# EAGLE design MOTOR_SLAVE_BRD_1 (EAGLE 9.5.2)
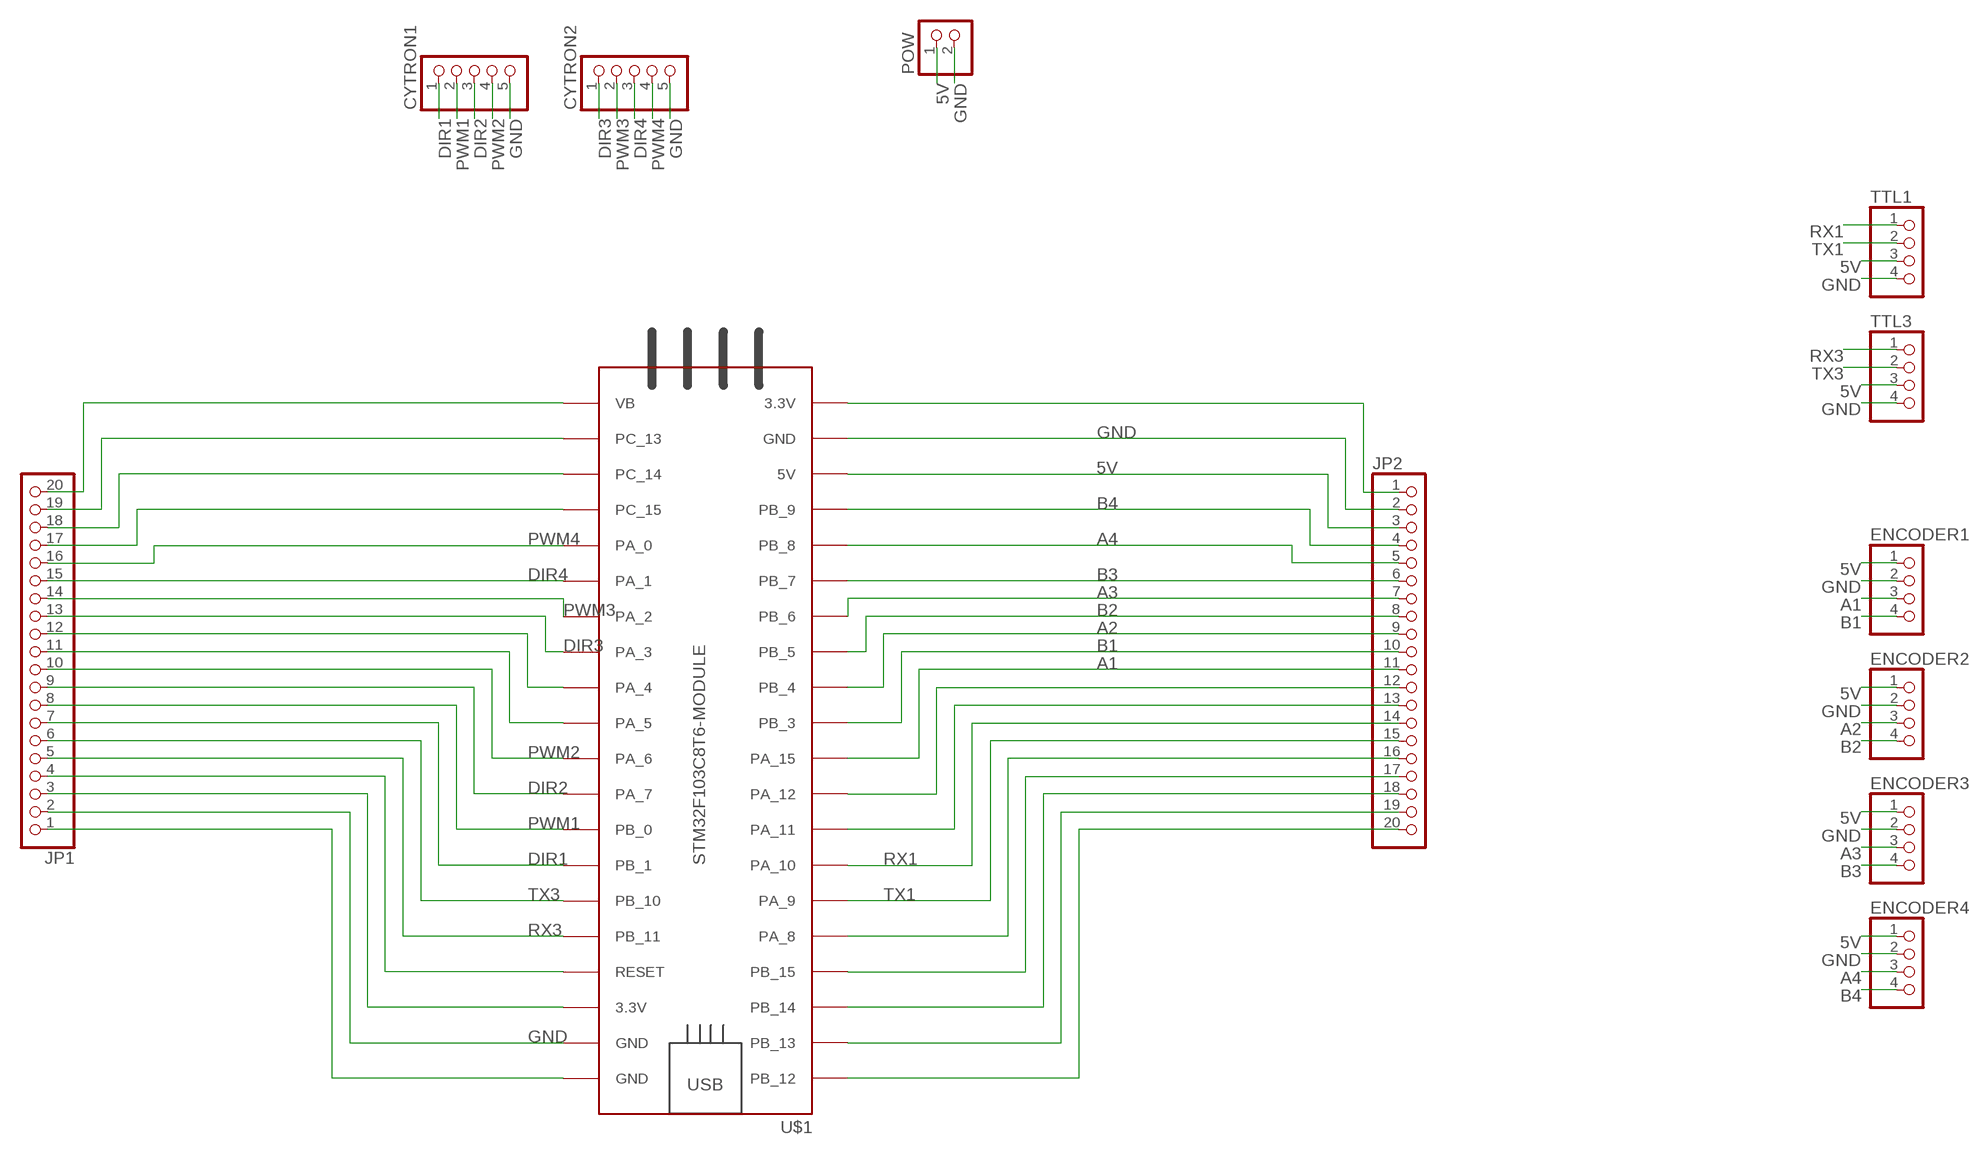
[diagram p0: schematic, sheet 1]

## Parts
CYTRON1  PINHD-5_DATA  [1X05_DATA]
CYTRON2  PINHD-5_DATA  [1X05_DATA]
ENCODER1  PINHD-4_DATA  [1X04_DATA]
ENCODER2  PINHD-4_DATA  [1X04_DATA]
ENCODER3  PINHD-4_DATA  [1X04_DATA]
ENCODER4  PINHD-4_DATA  [1X04_DATA]
JP1  PINHD-1X20  [1X20]
JP2  PINHD-1X20  [1X20]
POW  PINHD-2_DATA  [1X02_DATA]
TTL1  PINHD-4_DATA  [1X04_DATA]
TTL3  PINHD-4_DATA  [1X04_DATA]
U$1  STM32F103C8T6-MODULE  [STM32F103C8T6-MODULE]

## Nets
5V: ENCODER1.1 ENCODER2.1 ENCODER3.1 ENCODER4.1 JP2.3 POW.1 TTL1.3 TTL3.3 U$1.5V
A1: ENCODER1.3 JP2.11 U$1.PA_15
A2: ENCODER2.3 JP2.9 U$1.PB_4
A3: ENCODER3.3 JP2.7 U$1.PB_6
A4: ENCODER4.3 JP2.5 U$1.PB_8
B1: ENCODER1.4 JP2.10 U$1.PB_3
B2: ENCODER2.4 JP2.8 U$1.PB_5
B3: ENCODER3.4 JP2.6 U$1.PB_7
B4: ENCODER4.4 JP2.4 U$1.PB_9
DIR1: CYTRON1.1 JP1.7 U$1.PB_1
DIR2: CYTRON1.3 JP1.9 U$1.PA_7
DIR3: CYTRON2.1 JP1.13 U$1.PA_3
DIR4: CYTRON2.3 JP1.15 U$1.PA_1
GND: CYTRON1.5 CYTRON2.5 ENCODER1.2 ENCODER2.2 ENCODER3.2 ENCODER4.2 JP1.2 JP2.2 POW.2 TTL1.4 TTL3.4 U$1.GND_1(GND) U$1.GND_2(GND)
N$1: JP1.20 U$1.VB
N$2: JP1.19 U$1.PC_13
N$3: JP1.18 U$1.PC_14
N$5: JP1.17 U$1.PC_15
N$9: JP1.12 U$1.PA_4
N$10: JP1.11 U$1.PA_5
N$17: JP1.4 U$1.RESET
N$18: JP1.3 U$1.3.3V_2(3.3V)
N$20: JP1.1 U$1.GND_3(GND)
N$21: JP2.1 U$1.3.3V_1(3.3V)
N$32: JP2.12 U$1.PA_12
N$33: JP2.13 U$1.PA_11
N$36: JP2.16 U$1.PA_8
N$37: JP2.17 U$1.PB_15
N$38: JP2.18 U$1.PB_14
N$39: JP2.19 U$1.PB_13
N$40: JP2.20 U$1.PB_12
PWM1: CYTRON1.2 JP1.8 U$1.PB_0
PWM2: CYTRON1.4 JP1.10 U$1.PA_6
PWM3: CYTRON2.2 JP1.14 U$1.PA_2
PWM4: CYTRON2.4 JP1.16 U$1.PA_0
RX1: JP2.14 TTL1.1 U$1.PA_10
RX3: JP1.5 TTL3.1 U$1.PB_11
TX1: JP2.15 TTL1.2 U$1.PA_9
TX3: JP1.6 TTL3.2 U$1.PB_10

## Library data of the parts
CYTRON1 CYTRON2 = MIA_LIBRARY-2-2-2:PINHD-5_DATA: PIN HEADER
ENCODER1-ENCODER4 TTL1 TTL3 = MIA_LIBRARY-2-2-2:PINHD-4_DATA: PIN HEADER
JP1 JP2 = MIA_LIBRARY-2-2-2:PINHD-1X20: PIN HEADER
POW = MIA_LIBRARY-2-2-2:PINHD-2_DATA: PIN HEADER
U$1 = MIA_LIBRARY-2-2-2:STM32F103C8T6-MODULE: STM32F103C8T6 module with ARM Cortex-3, 20kB SRAM, 64kB Flash, 72MHz

## Board
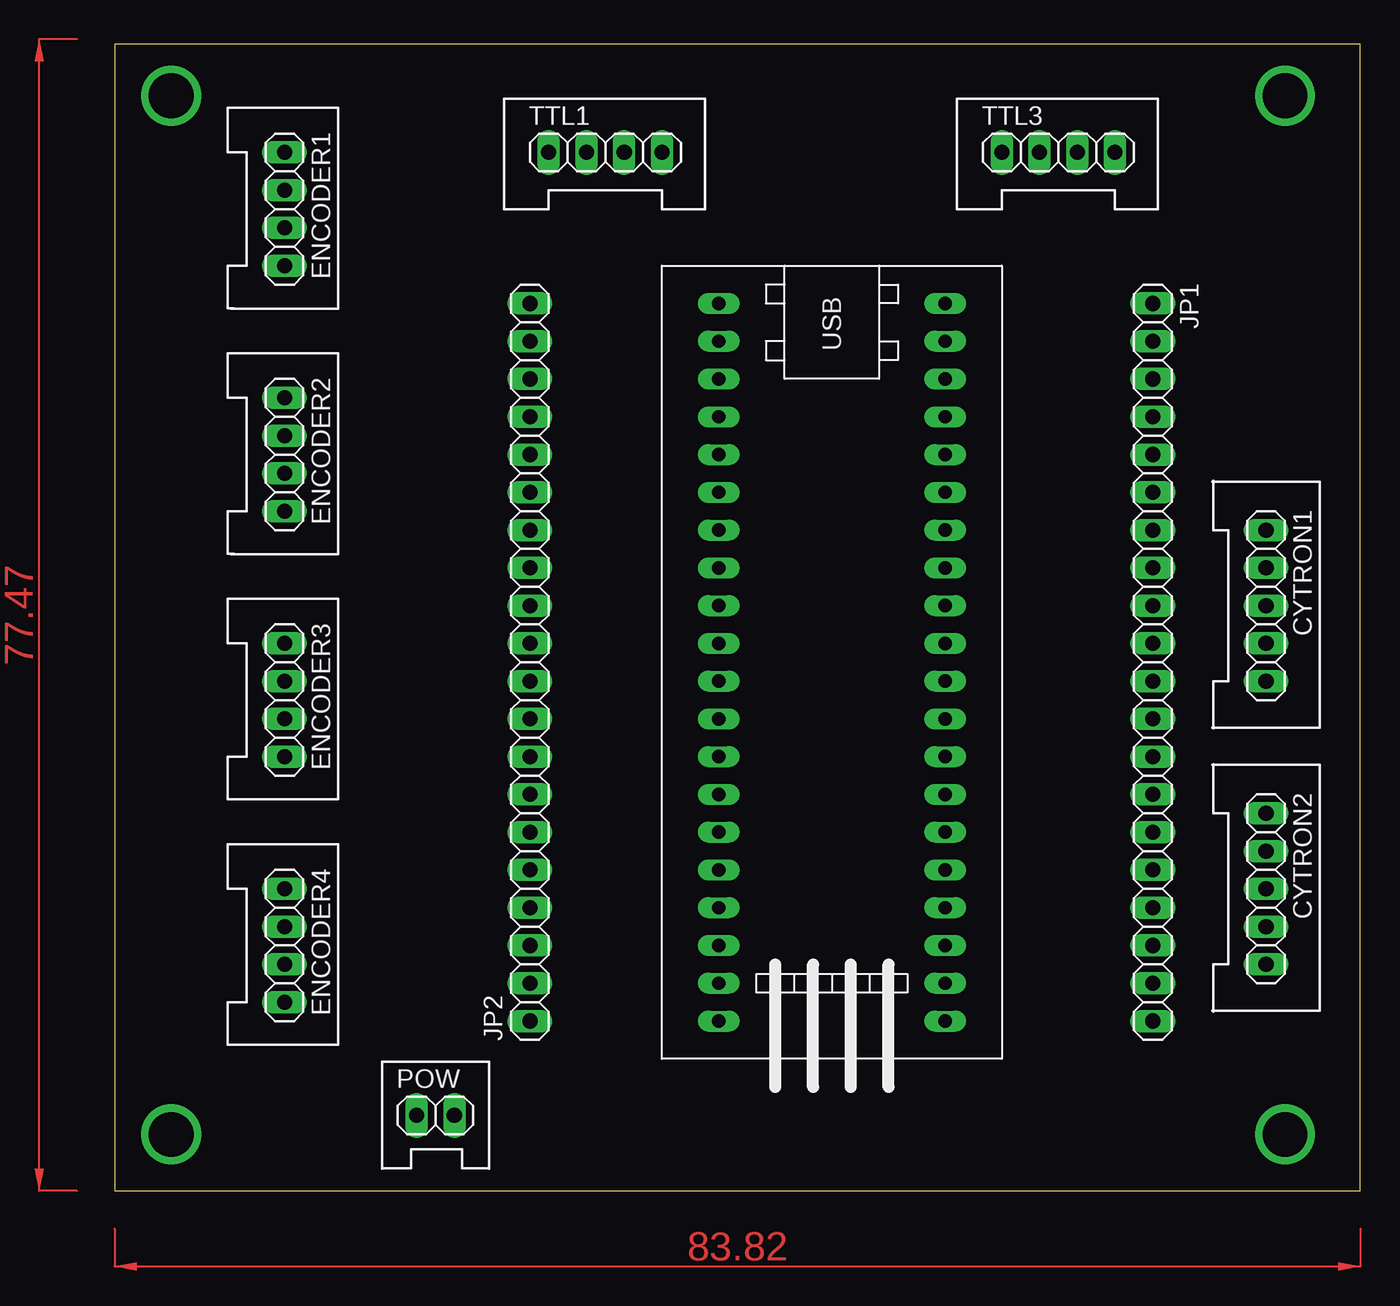
[diagram p1: board, top side]
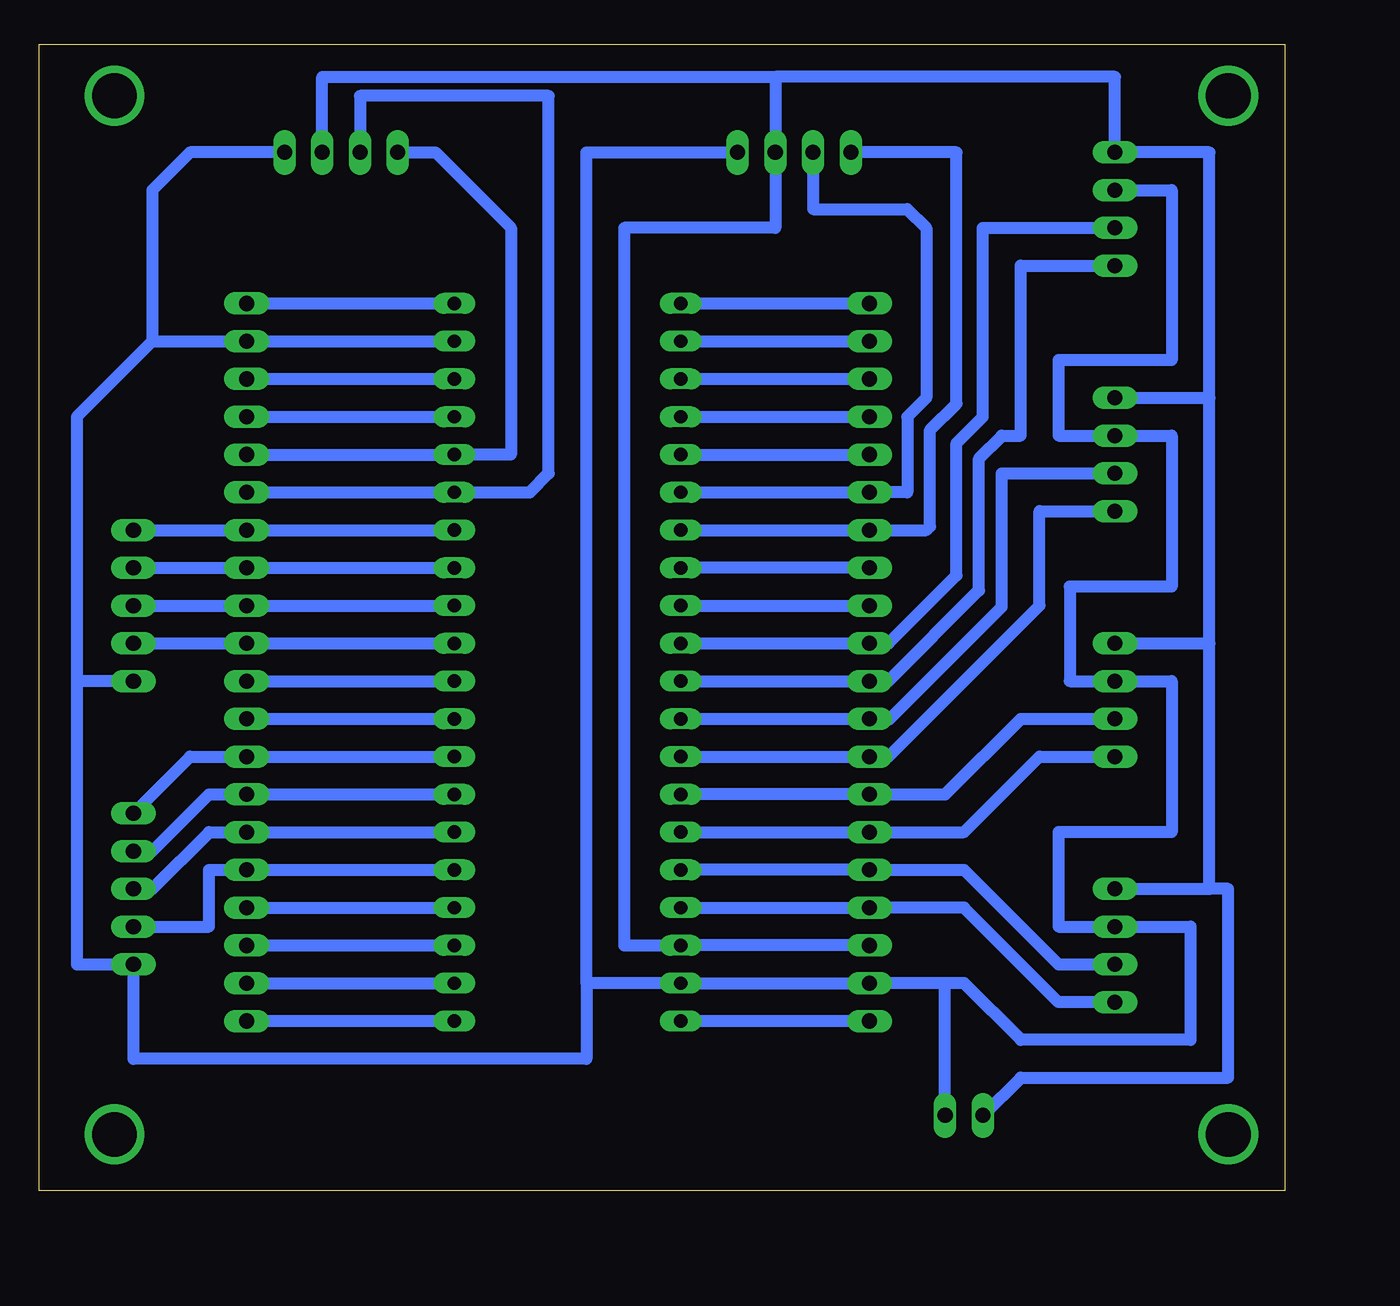
[diagram p2: board, bottom side, seen from below]

Size 83.8 x 77.14 mm. Coordinates in mm from the lower left corner, seen from the top.
Outline: 0,0 83.8,0 83.8,77.14 0,77.14 0,0
Copper layers (1*16): Top 0.035mm / dielectric 1.5mm / Bottom 0.035mm
Design rules "default": minimum track width 6mil, minimum drill 0.35mm, track to track 6mil, track to pad 6mil, pad to pad 6mil, via to via 6mil, smd to smd 6mil, copper to edge 40mil, drill to drill 6mil, minimum pad ring 10mil, minimum via ring 8mil, stop-mask expansion 4mil, vias tented up to drill 0mil, thermal gap 10mil

### Footprints (pad centres in the part's own frame; a part is rotated, then mirrored left to right if it is on the bottom)
1X05_DATA = drill 1.016 long: 1 -5.08,0; 2 -2.54,0; 3 0,0; 4 2.54,0; 5 5.08,0
1X04_DATA = drill 1.016 long: 1 -3.81,0; 2 -1.27,0; 3 1.27,0; 4 3.81,0
1X20 = drill 1.016 long: 1 -24.13,0; 2 -21.59,0; 3 -19.05,0; 4 -16.51,0; 5 -13.97,0; 6 -11.43,0; 7 -8.89,0; 8 -6.35,0; 9 -3.81,0; 10 -1.27,0; 11 1.27,0; 12 3.81,0; 13 6.35,0; 14 8.89,0; 15 11.43,0; 16 13.97,0; 17 16.51,0; 18 19.05,0; 19 21.59,0; 20 24.13,0
1X02_DATA = drill 1.016 long: 1 -1.27,0; 2 1.27,0
STM32F103C8T6-MODULE = drill 0.9 long: 3.3V_1 25.4,-7.62; 3.3V_2 -17.78,7.62; 5V 20.32,-7.62; GND_1 22.86,-7.62; GND_2 -20.32,7.62; GND_3 -22.86,7.62; PA_0 15.24,7.62; PA_1 12.7,7.62; PA_2 10.16,7.62; PA_3 7.62,7.62; PA_4 5.08,7.62; PA_5 2.54,7.62; PA_6 0,7.62; PA_7 -2.54,7.62; PA_8 -12.7,-7.62; PA_9 -10.16,-7.62; PA_10 -7.62,-7.62; PA_11 -5.08,-7.62; PA_12 -2.54,-7.62; PA_15 0,-7.62; PB_0 -5.08,7.62; PB_1 -7.62,7.62; PB_3 2.54,-7.62; PB_4 5.08,-7.62; PB_5 7.62,-7.62; PB_6 10.16,-7.62; PB_7 12.7,-7.62; PB_8 15.24,-7.62; PB_9 17.78,-7.62; PB_10 -10.16,7.62; PB_11 -12.7,7.62; PB_12 -22.86,-7.62; PB_13 -20.32,-7.62; PB_14 -17.78,-7.62; PB_15 -15.24,-7.62; PC_13 22.86,7.62; PC_14 20.32,7.62; PC_15 17.78,7.62; RESET -15.24,7.62; VB 25.4,7.62

### Placement (x,y rotation side)
CYTRON1  77.47,39.37 270 top
CYTRON2  77.47,20.32 270 top
ENCODER1  11.43,66.04 270 top
ENCODER2  11.43,49.53 270 top
ENCODER3  11.43,33.02 270 top
ENCODER4  11.43,16.51 270 top
JP1  69.85,35.56 270 top
JP2  27.94,35.56 90 top
POW  21.59,5.08 0 top
TTL1  33.02,69.85 0 top
TTL3  63.5,69.85 0 top
U$1  48.26,36.83 270 top

### Tracks (layer width: path | path; a pad name or v marks a point on that pad's centre or on a via)
5V
  Bottom 0.813: JP2.3 U$1.5V 44.45,16.51 44.45,64.77 34.29,64.77 TTL1.3 34.29,74.93 | TTL3.3 64.77,74.93 34.29,74.93 | 34.29,74.93 11.43,74.93 ENCODER1.1 5.08,69.85 5.08,53.34 | ENCODER4.1 5.08,20.32 | 5.08,20.32 5.08,36.83 | 5.08,36.83 5.08,53.34 | ENCODER2.1 5.08,53.34 | ENCODER3.1 5.08,36.83 | POW.1 17.78,7.62 3.81,7.62 3.81,20.32 5.08,20.32
A1
  Bottom 0.813: U$1.PA_15 JP2.11 26.67,36.83 22.1,41.4 22.1,50.29 20.32,52.07 20.32,53.34 20.32,54.61 20.32,64.77 ENCODER1.3
A2
  Bottom 0.813: U$1.PB_4 JP2.9 27.89,31.7 26.63,31.7 19.05,39.28 19.05,48.26 ENCODER2.3
A3
  Bottom 0.813: U$1.PB_6 JP2.7 22.86,26.67 17.78,31.75 ENCODER3.3
A4
  Bottom 0.813: U$1.PB_8 JP2.5 21.59,21.59 15.24,15.24 ENCODER4.3
B1
  Bottom 0.813: U$1.PB_3 JP2.10 26.67,34.29 20.57,40.39 20.57,49.28 19.05,50.8 17.78,50.8 17.78,62.23 ENCODER1.4
B2
  Bottom 0.813: U$1.PB_5 JP2.8 26.67,29.21 16.51,39.37 16.51,45.72 ENCODER2.4
B3
  Bottom 0.813: U$1.PB_7 JP2.6 21.59,24.13 16.51,29.21 ENCODER3.4
B4
  Bottom 0.813: U$1.PB_9 JP2.4 21.59,19.05 15.24,12.7 ENCODER4.4
DIR1
  Bottom 0.813: U$1.PB_1 JP1.7 CYTRON1.1
DIR2
  Bottom 0.813: U$1.PA_7 JP1.9 CYTRON1.3
DIR3
  Bottom 0.813: U$1.PA_3 JP1.13 73.66,29.21 CYTRON2.1
DIR4
  Bottom 0.813: U$1.PA_1 JP1.15 72.39,24.13 76.2,20.32 CYTRON2.3
GND
  Bottom 0.813: U$1.GND_2 JP1.2 76.2,57.15 | TTL3.4 73.66,69.85 76.2,67.31 76.2,57.15 | ENCODER1.2 7.62,67.31 7.62,55.88 15.24,55.88 15.24,50.8 ENCODER2.2 7.62,50.8 7.62,40.64 14.48,40.64 14.48,34.29 ENCODER3.2 7.62,34.29 7.62,24.13 15.24,24.13 15.24,17.78 ENCODER4.2 6.35,17.78 6.35,10.16 17.78,10.16 21.59,13.97 22.86,13.97 | 22.86,13.97 JP2.2 U$1.GND_1 46.99,13.97 | TTL1.4 46.99,69.85 46.99,13.97 | POW.2 22.86,13.97 | 46.99,13.97 46.99,8.89 77.47,8.89 CYTRON2.5 81.28,15.24 81.28,34.29 | CYTRON1.5 81.28,34.29 | 76.2,57.15 81.28,52.07 81.28,34.29
N$1
  Bottom 0.813: U$1.VB JP1.20
N$2
  Bottom 0.813: JP1.19 U$1.PC_13
N$3
  Bottom 0.813: JP1.18 U$1.PC_14
N$4  (via drill 3)
  other vias: 3.81,3.81
N$5
  Bottom 0.813: JP1.17 U$1.PC_15
N$6  (via drill 3)
  other vias: 78.74,73.66
N$7  (via drill 3)
  other vias: 78.74,3.81
N$8  (via drill 3)
  other vias: 3.81,73.66
N$9
  Bottom 0.813: JP1.12 U$1.PA_4
N$10
  Bottom 0.813: JP1.11 U$1.PA_5
N$17
  Bottom 0.813: JP1.4 U$1.RESET
N$18
  Bottom 0.813: JP1.3 U$1.3.3V_2
N$20
  Bottom 0.813: JP1.1 U$1.GND_3
N$21
  Bottom 0.813: JP2.1 U$1.3.3V_1
N$32
  Bottom 0.813: U$1.PA_12 JP2.12
N$33
  Bottom 0.813: JP2.13 U$1.PA_11
N$36
  Bottom 0.813: U$1.PA_8 JP2.16
N$37
  Bottom 0.813: U$1.PB_15 JP2.17
N$38
  Bottom 0.813: U$1.PB_14 JP2.18
N$39
  Bottom 0.813: U$1.PB_13 JP2.19
N$40
  Bottom 0.813: U$1.PB_12 JP2.20
PWM1
  Bottom 0.813: U$1.PB_0 JP1.8 CYTRON1.2
PWM2
  Bottom 0.813: U$1.PA_6 JP1.10 CYTRON1.4
PWM3
  Bottom 0.813: U$1.PA_2 JP1.14 72.39,26.67 76.2,22.86 CYTRON2.2
PWM4
  Bottom 0.813: U$1.PA_0 JP1.16 72.39,21.59 72.39,17.78 CYTRON2.4
RX1
  Bottom 0.813: U$1.PA_10 JP2.14 24.13,44.45 23.88,44.7 23.88,51.18 22.1,52.96 22.1,69.85 TTL1.1
RX3
  Bottom 0.813: JP1.5 U$1.PB_11 52.07,49.53 52.07,64.77 57.15,69.85 TTL3.1
TX1
  Bottom 0.813: U$1.PA_9 JP2.15 25.4,46.99 25.4,52.07 24.13,53.34 24.13,64.77 25.4,66.04 31.75,66.04 TTL1.2
TX3
  Bottom 0.813: JP1.6 U$1.PB_10 50.8,46.99 49.53,48.26 49.53,73.66 62.23,73.66 TTL3.2
(copper drawn outside any net)
  shapes: Top area x2